# EAGLE board ElectronicLoad (EAGLE 9.5.1)
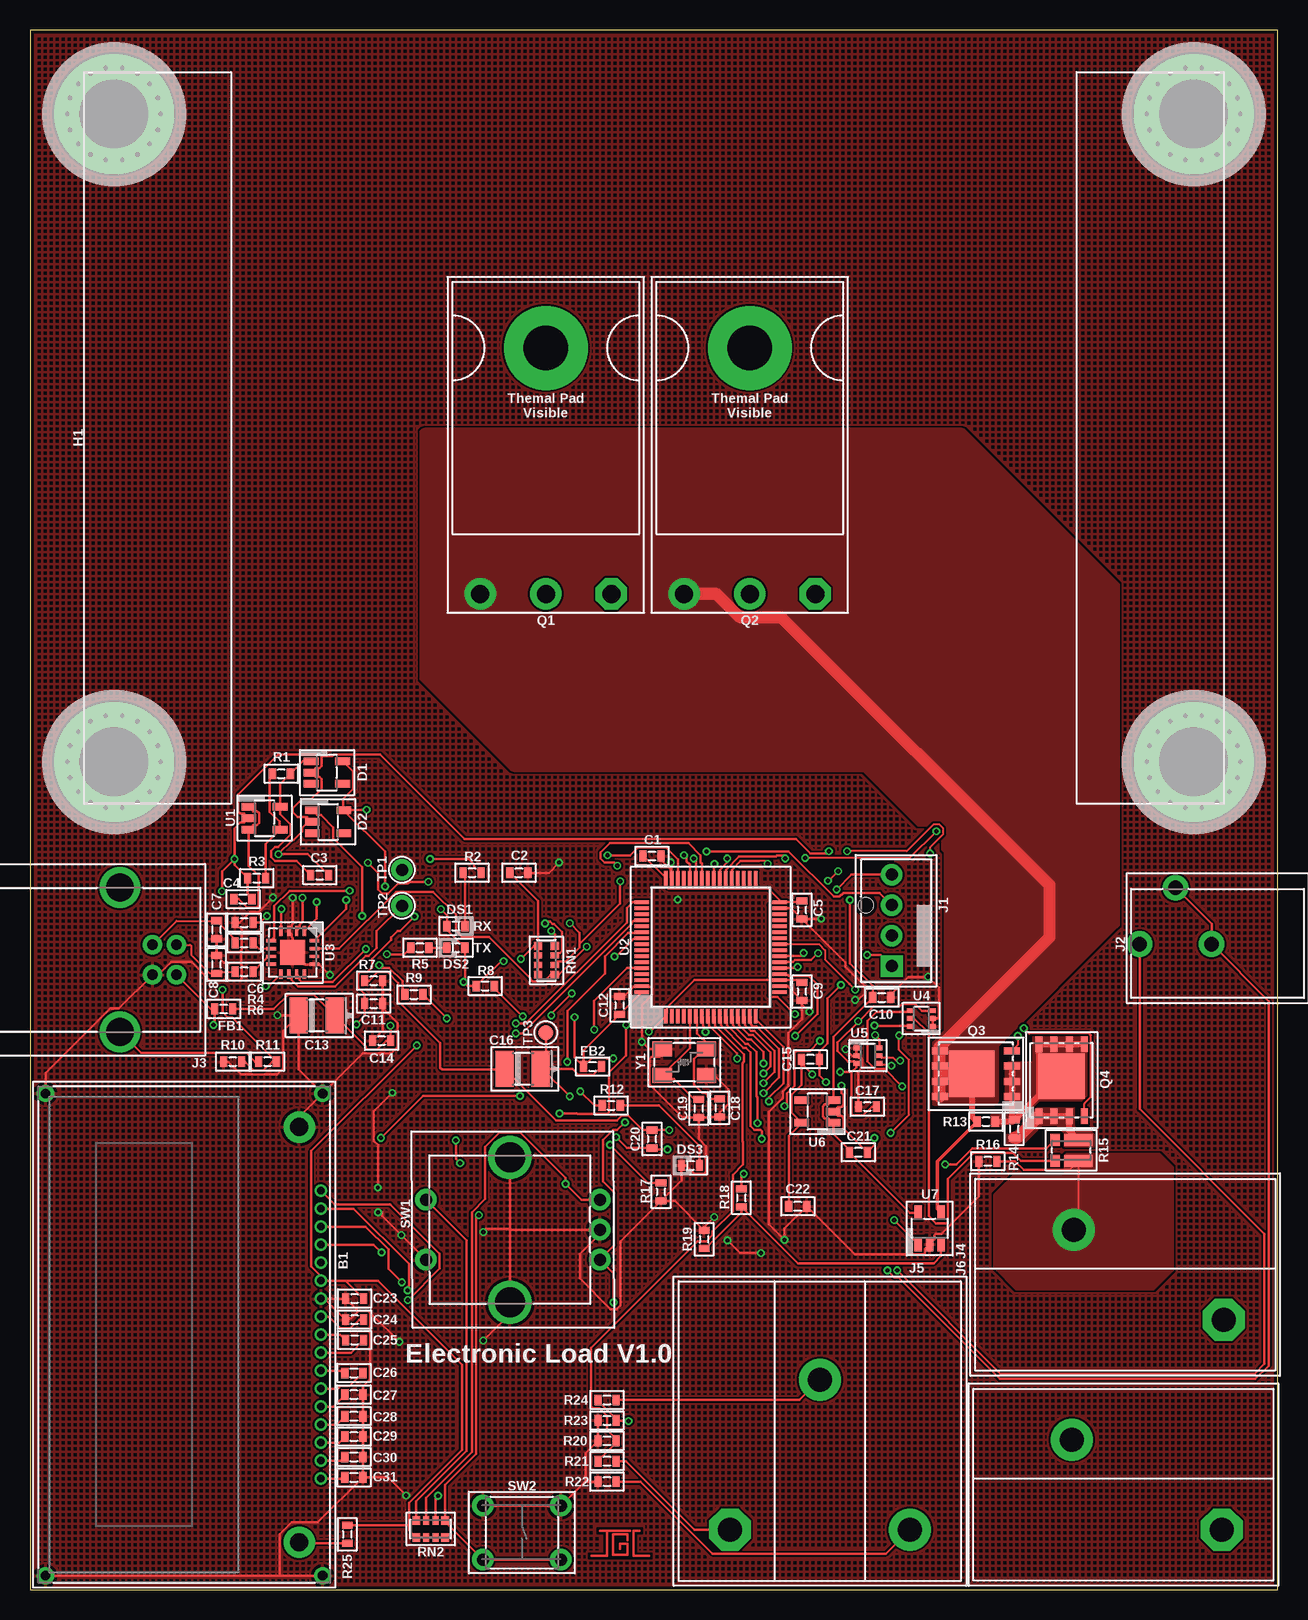
[diagram p5: board, top side]
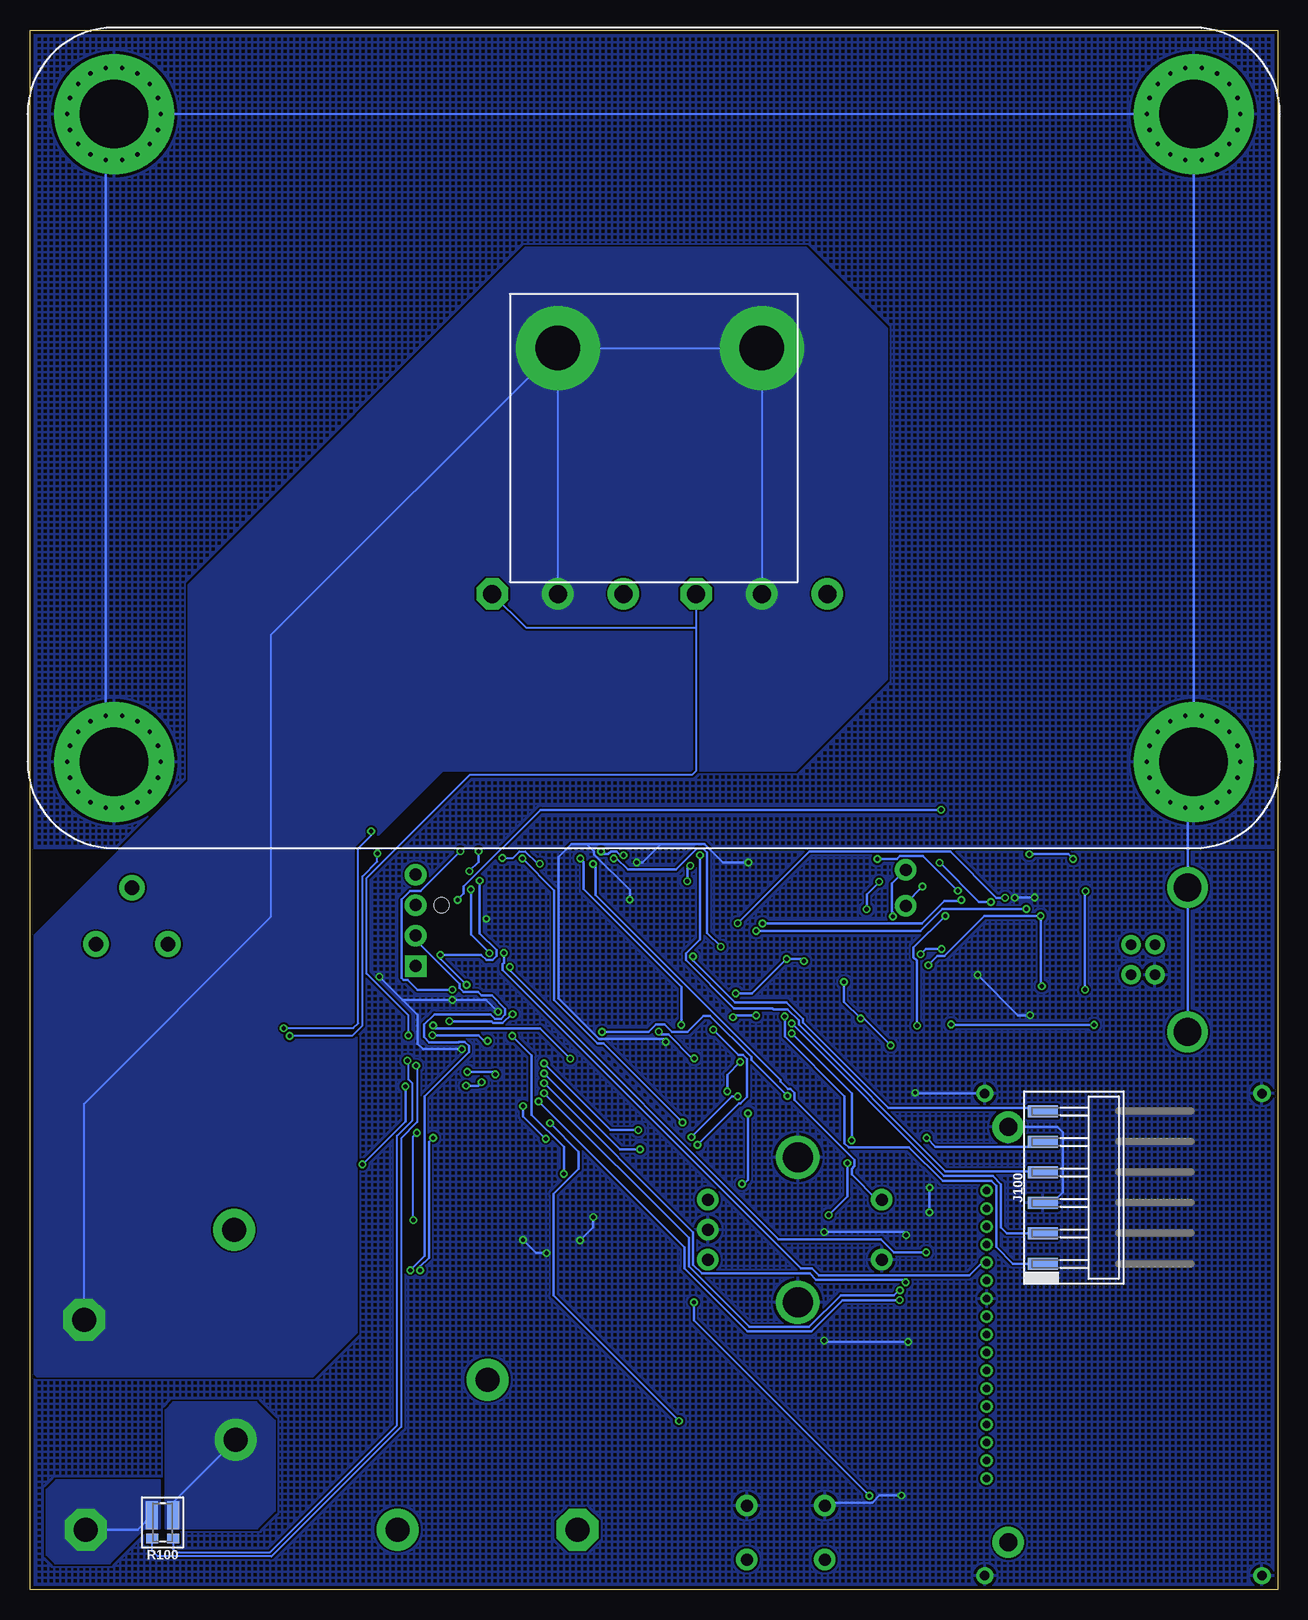
[diagram p6: board, bottom side, seen from below]

Size 104 x 130 mm. Coordinates in mm from the lower left corner, seen from the top.
Outline: 104,130 0,130 0,0 104,0 104,130
Copper layers (1*16): Top 0.035mm / dielectric 1.6mm / Bottom 0.035mm
Design rules "CougsInSpace": minimum track width 0.16mm, minimum drill 0.3mm, track to track 0.16mm, track to pad 0.16mm, pad to pad 0.16mm, via to via 0.16mm, smd to smd 0mil, copper to edge 0.3mm, drill to drill 0.3mm, minimum pad ring 0.15mm, minimum via ring 0.15mm, stop-mask expansion 0mil, vias tented up to drill 1mm, thermal gap 0.25mm

## Footprints (pad centres in the part's own frame; a part is rotated, then mirrored left to right if it is on the bottom)
NHD-C12832A1Z = drill 0.6 pad 1: 1 -12,0; 2 -10.5,0; 3 -9,0; 4 -7.5,0; 5 -6,0; 6 -4.5,0; 7 -3,0; 8 -1.5,0; 9 0,0; 10 1.5,0; 11 3,0; 12 4.5,0; 13 6,0; 14 7.5,0; 15 9,0; 16 10.5,0; 17 12,0 | drill 1.5 pad 2: A -17.3,1.8; K 17.3,1.8 | drill 0.8 pad 1.4: CHASSIS@1 -20.1,-0.15; CHASSIS@2 20.1,-0.15; CHASSIS@3 -20.1,22.95; CHASSIS@4 20.1,22.95
1608 = smd 0.6 x 0.9: 1 -0.75,0; 2 0.75,0
4028-POL = smd 1.5 x 3: A 1.5,0; C -1.5,0
SOT23-5 = smd 1.22 x 0.62: 1 -1.31,0.95; 2 -1.31,0; 3 -1.31,-0.95; 4 1.31,-0.95; 5 1.31,0.95
1608-POL = smd 0.6 x 0.9: A 0.75,0; C -0.75,0
HEATSINK-AM4 = drill 5.7 pad 10: 1 -45,27; 2 -45,-27; 3 45,-27; 4 45,27 | drill 0.35 pad 1: V1 -41.1,27; V2 -41.335,28.334; V3 -42.012,29.507; V4 -43.05,30.378; V5 -44.323,30.841; V6 -45.677,30.841; V7 -46.95,30.378; V8 -47.988,29.507; V9 -48.665,28.334; V10 -48.9,27; V11 -48.665,25.666; V12 -47.988,24.493; V13 -46.95,23.622; V14 -45.677,23.159; V15 -44.323,23.159; V16 -43.05,23.622; V17 -42.012,24.493; V18 -41.335,25.666; V19 -41.1,-27; V20 -41.335,-25.666; V21 -42.012,-24.493; V22 -43.05,-23.622; V23 -44.323,-23.159; V24 -45.677,-23.159; V25 -46.95,-23.622; V26 -47.988,-24.493; V27 -48.665,-25.666; V28 -48.9,-27; V29 -48.665,-28.334; V30 -47.988,-29.507; V31 -46.95,-30.378; V32 -45.677,-30.841; V33 -44.323,-30.841; V34 -43.05,-30.378; V35 -42.012,-29.507; V36 -41.335,-28.334; V37 48.9,-27; V38 48.665,-25.666; V39 47.988,-24.493; V40 46.95,-23.622; V41 45.677,-23.159; V42 44.323,-23.159; V43 43.05,-23.622; V44 42.012,-24.493; V45 41.335,-25.666; V46 41.1,-27; V47 41.335,-28.334; V48 42.012,-29.507; V49 43.05,-30.378; V50 44.323,-30.841; V51 45.677,-30.841; V52 46.95,-30.378; V53 47.988,-29.507; V54 48.665,-28.334; V55 48.9,27; V56 48.665,28.334; V57 47.988,29.507; V58 46.95,30.378; V59 45.677,30.841; V60 44.323,30.841; V61 43.05,30.378; V62 42.012,29.507; V63 41.335,28.334; V64 41.1,27; V65 41.335,25.666; V66 42.012,24.493; V67 43.05,23.622; V68 44.323,23.159; V69 45.677,23.159; V70 46.95,23.622; V71 47.988,24.493; V72 48.665,25.666
THT2.54-1X04-LOCK = drill 1 square: 1 5.08,0 | drill 1: 2 2.54,0; 3 0,0; 4 -2.54,0 | hole 1.25: 0,-2.16
BARREL-2.1X5.5-R = drill 1.2 pad 2: 1 0,-3; 2 0,3; 3 -4.7,0
USB-B-FEMALE = drill 0.9 pad 1.6: 1 1.25,4.71; 2 -1.25,4.71; 3 -1.25,2.71; 4 1.25,2.71 | drill 2.3 pad 3.4: SHIELD@1 -6.02,0; SHIELD@2 6.02,0
TERMINAL_SPRING-02 = drill 2 pad 3.5 octagon: 1 0,0 | drill 2 pad 3.5: 2 7.5,12.5
TERMINAL_SPRING-03 = drill 2 pad 3.5 octagon: 1 0,0 | drill 2 pad 3.5: 2 7.5,12.5; 3 15,0
SMD2.54-1X06-R = smd 1 x 2.5: 1 6.35,-5; 2 3.81,-5; 3 1.27,-5; 4 -1.27,-5; 5 -3.81,-5; 6 -6.35,-5
TO-247-3-DOWN = drill 1.5 pad 2.5 octagon: 1 -5.46,0 | drill 1.5 pad 2.5: 2 0,0; 3 5.46,0 | drill 3.7 pad 7: PAD 0,-20.5
POWERPAK-SO-8 = smd 1.3 x 0.6: 1 -3,1.905; 2 -3,0.635; 3 -3,-0.635; 4 -3,-1.905; 5 3,-1.905; 6 3,-0.635; 7 3,0.635; 8 3,1.905 | smd 3.8 x 3.9: PAD 0.35,0
1632-KELVIN = smd 1 x 2.32: 1 -0.875,-0.59; 2 0.9,-0.59 | smd 1 x 0.8: 1-KELVIN -0.875,1.35; 2-KELVIN 0.875,1.35
1632 = smd 0.64 x 0.7: 1 -1.2,-0.7; 4 1.2,-0.7; 5 1.2,0.7; 8 -1.2,0.7 | smd 0.5 x 0.7: 2 -0.4,-0.7; 3 0.4,-0.7; 6 0.4,0.7; 7 -0.4,0.7
PEC12R-4-S = drill 1 pad 1.6: 1 -2.5,7; 2 2.5,7; A -2.5,-7.5; B 2.5,-7.5; C 0,-7.5 | drill 2.5 pad 3.6: SHIELD@1 -6.05,0; SHIELD@2 6.02,0
THT-6060 = drill 1 pad 1.6: 1 3.25,-2.25; 2 -3.25,-2.25; 3 3.25,2.25; 4 -3.25,2.25
THT-1.0 = drill 1 pad 1.8: 1 0,0
SMD-C-1.25 = smd 1.25 x 1.25: 1 0,0
QFP-64-1010 = smd 1.2 x 0.3: 1 -5.75,3.75; 2 -5.75,3.25; 3 -5.75,2.75; 4 -5.75,2.25; 5 -5.75,1.75; 6 -5.75,1.25; 7 -5.75,0.75; 8 -5.75,0.25; 9 -5.75,-0.25; 10 -5.75,-0.75; 11 -5.75,-1.25; 12 -5.75,-1.75; 13 -5.75,-2.25; 14 -5.75,-2.75; 15 -5.75,-3.25; 16 -5.75,-3.75; 33 5.75,-3.75; 34 5.75,-3.25; 35 5.75,-2.75; 36 5.75,-2.25; 37 5.75,-1.75; 38 5.75,-1.25; 39 5.75,-0.75; 40 5.75,-0.25; 41 5.75,0.25; 42 5.75,0.75; 43 5.75,1.25; 44 5.75,1.75; 45 5.75,2.25; 46 5.75,2.75; 47 5.75,3.25; 48 5.75,3.75 | smd 0.3 x 1.2: 17 -3.75,-5.75; 18 -3.25,-5.75; 19 -2.75,-5.75; 20 -2.25,-5.75; 21 -1.75,-5.75; 22 -1.25,-5.75; 23 -0.75,-5.75; 24 -0.25,-5.75; 25 0.25,-5.75; 26 0.75,-5.75; 27 1.25,-5.75; 28 1.75,-5.75; 29 2.25,-5.75; 30 2.75,-5.75; 31 3.25,-5.75; 32 3.75,-5.75; 49 3.75,5.75; 50 3.25,5.75; 51 2.75,5.75; 52 2.25,5.75; 53 1.75,5.75; 54 1.25,5.75; 55 0.75,5.75; 56 0.25,5.75; 57 -0.25,5.75; 58 -0.75,5.75; 59 -1.25,5.75; 60 -1.75,5.75; 61 -2.25,5.75; 62 -2.75,5.75; 63 -3.25,5.75; 64 -3.75,5.75
QFN-16-4040 = smd 0.8 x 0.28: 1 -1.8,0.975; 2 -1.8,0.325; 3 -1.8,-0.325; 4 -1.8,-0.975; 9 1.8,-0.975; 10 1.8,-0.325; 11 1.8,0.325; 12 1.8,0.975 | smd 0.28 x 0.8: 5 -0.975,-1.8; 6 -0.325,-1.8; 7 0.325,-1.8; 8 0.975,-1.8; 13 0.975,1.8; 14 0.325,1.8; 15 -0.325,1.8; 16 -0.975,1.8 | smd 2.1 x 2.1: PAD 0,0
SOT363 = smd 0.5 x 0.4: 1 -0.95,0.65; 2 -0.95,0; 3 -0.95,-0.65; 4 0.95,-0.65; 5 0.95,0; 6 0.95,0.65
SMD-5032 = smd 1.6 x 1.25: 1 -1.85,-1.1; 2 1.85,-1.1; 3 1.85,1.1; 4 -1.85,1.1

## Placement (x,y rotation side)
B1  128x32p White on Blue  [NHD-C12832A1Z]  24.25,21.25 90 top
C1  100nF 10%  [1608]  51.85,61.15 0 top
C2  100nF 10%  [1608]  40.75,59.75 0 top
C3  1µF 10%  [1608]  24.15,59.55 0 top
C4  1µF 10%  [1608]  17.75,57.55 0 top
C5  100nF 10%  [1608]  64.35,56.65 270 top
C6  100nF 10%  [1608]  17.85,55.6 180 top
C7  47pF 5%  [1608]  15.55,55 270 top
C8  47pF 5%  [1608]  15.55,52.1 90 top
C9  100nF 10%  [1608]  64.35,49.85 270 top
C10  100nF 10%  [1608]  71,49.35 0 top
C11  10nF 10%  [1608]  28.65,48.85 0 top
C12  100nF 10%  [1608]  49.15,48.7 90 top
C13  4.7µF 10%  [4028-POL]  23.9,47.85 0 top
C14  100nF 10%  [1608]  29.3,45.75 180 top
C15  1µF 10%  [1608]  65.05,44.2 0 top
C16  4.7µF 10%  [4028-POL]  41.05,43.4 0 top
C17  100nF 10%  [1608]  69.8,40.25 180 top
C18  10pF 5%  [1608]  57.5,40.15 270 top
C19  10pF 5%  [1608]  55.75,40.1 270 top
C20  100nF 10%  [1608]  51.85,37.55 90 top
C21  1µF 10%  [1608]  69.05,36.45 0 top
C22  100nF 10%  [1608]  64,31.95 0 top
C23  100nF 10%  [1608]  27.05,24.25 180 top
C24  1µF 10%  [1608]  27.05,22.5 0 top
C25  1nF 1%  [1608]  27.05,20.8 180 top
C26  1nF 1%  [1608]  27,18.05 0 top
C27  1µF 10%  [1608]  27,16.25 0 top
C28  1µF 10%  [1608]  27,14.45 0 top
C29  1µF 10%  [1608]  27,12.75 0 top
C30  1µF 10%  [1608]  27,11.05 0 top
C31  1µF 10%  [1608]  27,9.35 0 top
D1  LTC4411  [SOT23-5]  24.75,68.1 0 top
D2  LTC4411  [SOT23-5]  24.85,64 0 top
DS1  Red  [1608-POL]  35.5,55.3 180 top
DS2  Green  [1608-POL]  35.5,53.5 0 top
DS3  Green  [1608-POL]  55.05,35.35 0 top
FB1  1.5kΩ @ 100MHz  [1608]  16.15,48.4 0 top
FB2  1.5kΩ @ 100MHz  [1608]  46.9,43.6 0 top
H1  AM4 Heatsink  [HEATSINK-AM4]  52,96 0 top
J1  FAN  [THT2.54-1X04-LOCK]  71.85,57.05 270 top
J2  12 V Input  [BARREL-2.1X5.5-R]  95.5,53.8 270 top
J3  USB  [USB-B-FEMALE]  7.5,52.5 270 top
J4  Load Input  [TERMINAL_SPRING-02]  99.5,22.5 90 top
J5  Voltage Input  [TERMINAL_SPRING-03]  58.35,5 0 top
J6  Auxiliary Current Input  [TERMINAL_SPRING-02]  99.35,5 90 top
J100  SWD  [SMD2.54-1X06-R]  14.55,33.5 270 bottom
LOGO1  SIGNATUREJAYSON  [SIGN-JAYSON]  49.2,3.8 0 top
Q1  IRFP4368PBF  [TO-247-3-DOWN]  43,83 180 top
Q2  IRFP4368PBF  [TO-247-3-DOWN]  60,83 180 top
Q3  SiRA20DP  [POWERPAK-SO-8]  78.85,43 180 top
Q4  SiRA20DP  [POWERPAK-SO-8]  86,42.45 90 top
R1  10kΩ 0.1%  [1608]  20.95,68 0 top
R2  1kΩ 0.1%  [1608]  36.85,59.75 180 top
R3  30kΩ 1%  [1608]  18.9,59.3 0 top
R4  27Ω 1%  [1608]  17.85,53.9 0 top
R5  1kΩ 0.1%  [1608]  32.5,53.5 0 top
R6  27Ω 1%  [1608]  17.85,51.5 0 top
R7  0Ω <20mΩ  [1608]  28.65,50.75 0 top
R8  1kΩ 0.1%  [1608]  37.95,50.3 180 top
R9  10kΩ 0.1%  [1608]  32,49.6 180 top
R10  0Ω <20mΩ  [1608]  16.9,44 180 top
R11  0Ω <20mΩ  [1608]  19.8,44 180 top
R12  1kΩ 0.1%  [1608]  48.45,40.35 180 top
R13  510mΩ 1%  [1608]  79.7,39 180 top
R14  50mΩ 1%  [1608]  82.05,38.4 90 top
R15  5mΩ 1%  [1632-KELVIN]  86.8,36.6 90 top
R16  1kΩ 0.1%  [1608]  79.85,35.7 0 top
R17  0Ω <20mΩ  [1608]  52.6,33.15 90 top
R18  47kΩ 0.1%  [1608]  59.3,32.65 90 top
R19  1kΩ 0.1%  [1608]  56.2,29.2 270 top
R20  10kΩ 0.1%  [1608]  48.1,12.4 0 top
R21  30kΩ 1%  [1608]  48.1,10.7 0 top
R22  1kΩ 0.1%  [1608]  48.1,9 0 top
R23  10kΩ 0.1%  [1608]  48.1,14.1 0 top
R24  30kΩ 1%  [1608]  48.1,15.8 0 top
R25  0Ω <20mΩ  [1608]  26.45,4.6 270 top
R100  5mΩ 1%  [1632-KELVIN]  92.95,5.6 180 bottom
RN1  10kΩ 1%  [1632]  43.05,52.45 90 top
RN2  10kΩ 1%  [1632]  33.4,5.05 180 top
SW1  Control Knob  [PEC12R-4-S]  40,30 90 top
SW2  Nice Button  [THT-6060]  41,4.75 0 top
TP1  TEST_POINT-THT-1.0  [THT-1.0]  31,60 0 top
TP2  TEST_POINT-THT-1.0  [THT-1.0]  31,57 0 top
TP3  TEST_POINT-SMD-C-1.25  [SMD-C-1.25]  43,46.4 0 top
U1  TPS73250  [SOT23-5]  19.55,64.3 0 top
U2  STM32L476RGT  [QFP-64-1010]  56.75,53.55 90 top
U3  FT230XQ  [QFN-16-4040]  21.9,53.1 270 top
U4  INA199C1  [SOT363]  74.3,47.6 180 top
U5  INA199C1  [SOT363]  69.85,44.5 0 top
U6  LP5907MFX-3.1  [SOT23-5]  65.65,39.85 180 top
U7  AD8515  [SOT23-5]  75,30.1 90 top
Y1  8MHz ±10ppm  [SMD-5032]  54.55,43.95 180 top

## Tracks (layer width: path | path; a pad name or v marks a point on that pad's centre or on a via)
3.1V  (via drill 0.35)
  Top 0.2: RN2.8 RN2.7 RN2.6 RN2.5 31.6,4.95 31.6,5.35 | 31.6,5.35 R25.1 | B1.12 29,25.75 36,18.75 36,11.65 31.6,7.25 31.6,5.35 | C1.1 | C2.1 42.35,57.4 RN1.5 | R9.1 v34.75,47.6 | B1.12 24.25,26.12 23.45,26.92 23.45,36.55 v32.25,45.35 | B1.12 26.3,25.75 C23.1 | U2.19 62.55,50.8 | 62.55,50.8 64.15,50.8 C9.1 | 62.65,57.3 U2.32 62.41,57.21 61.79,57.21 61.64,57.06 61.64,51.04 61.83,50.85 62.5,50.85 62.55,50.8 | 62.65,57.3 64.25,57.3 C5.1 | U2.64 C12.1 46.15,44.95 FB2.1 | C1.1 51.15,61.15 U2.48 53.05,59.25 53.05,58.63 53.24,58.44 61.51,58.44 62.65,57.3 | C22.1 63.25,37.81 U6.5 63.47,39.77 63.47,41.22 64.3,42.05 C15.1 64.3,43.86 v65.22,42.95 | 68.49,43.13 68.9,43.54 U5.3 68.71,44.04 68.18,44.04 67.32,44.9 67.32,45.6 69.09,47.36 | 68.49,43.13 68.49,39.69 68.64,39.54 69.46,39.54 70.17,40.25 C17.1 | U4.3 74.37,48.25 73.82,48.8 72.7,48.8 72.49,48.59 70.31,48.59 69.09,47.36 | U3.1 23.9,55.92 v23.9,57.32 | v33.2,59 31.64,59 31.48,58.84 30.67,58.84 29.84,58.02 29.36,58.02 29.02,58.36 29.02,59.73 v28.16,60.59 | v34.25,56.7 34.75,56.2 DS1.A 34.75,55 DS2.A 36.25,50.75 v36.14,50.64 36.48,50.3 R8.2 39.27,52.37 v39.47,52.37 | 68.49,43.13 68.47,43.15 v67.55,43.15 | RN1.8 RN1.7 | FB2.1 45.38,44.36 v45.38,47.7 | v43.45,47.85 43.45,47.98 v45.16,49.69 | v40.92,52.57 42,53.65 RN1.5 | U2.19 55.38,50.8 53.09,48.51 53.09,48.05 53,47.96 U2.1 51.7,46.5 v51.59,46.5 | v48.62,44.28 48.09,44.28 48.06,44.31 46.86,44.31 FB2.1 | RN1.7 RN1.5 | RN1.6 RN1.7 | U2.19 62.41,50.71 61.79,50.71 61.64,50.56 61.64,49.54 61.79,49.39 62.33,49.39 v63.77,47.95 | v69.04,47.37 69.08,47.37 69.09,47.36
  Bottom 0.2: v32.25,45.35 34.5,47.6 v34.75,47.6 36.14,48.99 v36.14,50.64 | v23.9,57.32 24.89,57.32 v28.16,60.59 | v33.2,59 34.25,57.95 v34.25,56.7 | v67.55,43.15 65.41,43.15 v65.22,42.95 | v45.38,47.7 45.23,47.85 v43.45,47.85 | v45.16,49.69 43.81,49.69 v40.92,52.57 39.67,52.57 v39.47,52.37 | v51.59,46.5 51.34,46.26 50.78,46.26 48.8,44.28 v48.62,44.28 | v63.77,47.95 63.86,47.95 64.59,47.22 65.38,47.22 65.53,47.37 v69.04,47.37
5.0V  (via drill 0.35)
  Top 0.2: TP2.1 28.9,54.9 28.9,53.47 28.24,52.81 27.96,52.81 25.43,50.28 22.34,50.28 21.82,50.79 21.82,51.05 U3.10 | U7.5 73.34,31.41 C21.1 68.4,36.55 66.96,37.99 U6.1 66.58,39.28 66.24,39.28 66.09,39.43 66.09,40.27 66.24,40.42 66.58,40.42 U6.3 66.96,46.06 C10.1 70.25,50.3 68.35,52.2 v68.35,57.49 | D1.5 26.93,68.18 26.93,66.73 26.1,65.9 26.1,64.95 D2.5 26.2,64.91 | 26.2,64.91 29.6,61.51 v29.6,58.6 | v28.05,65 26.3,65 26.2,64.91
  Bottom 0.2: v29.6,58.6 31,57.2 TP2.1 | v68.35,57.49 67.84,58.01 67.84,58.59 61.43,65 v28.05,65
12.0V  (via drill 0.35)
  Top 0.2: J2.1 92.5,40.05 102.9,29.65 102.9,18.8 102.1,18 80.91,18 v72.3,26.62
  Bottom 0.2: v72.3,26.62 71.1,27.81 71.1,41.12 67.41,44.81 67.41,45.29 67.76,45.64 68.24,45.64 68.26,45.62 70.72,45.62 71.15,46.05 71.15,47.09 70.28,47.96 65.61,47.96 65.23,47.58 64.74,47.58 64.4,47.92 64.4,48.41 65.5,49.5 66.35,49.5 66.66,49.81 67.84,49.81 68.18,50.15 68.18,50.47 71.85,54.14 J1.2
!CTS  (via drill 0.35)
  Top 0.2: RN1.4 43.75,54.6 v43.45,54.9 | v20.95,56.73 20.95,54.92 U3.4
  Bottom 0.2: v43.45,54.9 29.77,54.9 27.93,56.74 27.44,56.74 27.44,56.73 v20.95,56.73
!LCD_CS  (via drill 0.35)
  Top 0.2: U2.16 60.5,47.51 62.8,45.21 62.8,42.21 61.6,41 v61.6,40.69 | B1.17 25.39,32.11 30.03,32.11 34.16,27.98 34.16,26.78 v31.5,24.12
  Bottom 0.2: v61.6,40.69 49.44,28.53 49.44,26.78 44.19,21.53 38.84,21.53 36.25,24.12 v31.5,24.12
!LCD_RST  (via drill 0.35)
  Top 0.2: U2.15 60.09,47.71 60.09,47.09 60.24,46.94 60.56,46.94 62.44,45.06 62.44,42.67 v61.13,41.37 | v31.47,24.93 31.47,25.25 31.59,25.36 31.59,27.15 26.99,31.75 B1.16
  Bottom 0.2: v61.13,41.37 49.08,29.31 49.08,26.93 44.04,21.89 39.05,21.89 36.41,24.53 31.97,24.53 31.57,24.93 v31.47,24.93
!RTS  (via drill 0.35)
  Top 0.2: RN1.3 43.97,53.07 44.21,53.07 44.36,53.22 44.36,54.82 43.69,55.48 43.56,55.48 43.35,55.7 43.1,55.7 v42.94,55.53 | v26.35,57.47 26.35,56.73 U3.16
  Bottom 0.2: v42.94,55.53 29.64,55.53 27.78,57.4 26.42,57.4 v26.35,57.47
AGND  (via drill 0.35)
  Top 0.2: U2.12 58.59,47.71 58.59,47.06 59.8,45.86 60.09,45.86 61.13,44.81 v61.13,43.85 | v53.3,38.3 C20.2 51.08,38.3 49.84,39.53 49.36,39.53 48.92,39.1 43.85,39.1 C16.C 39.49,43.34 34.34,43.34 34.19,43.49 34.19,45.54 30.69,49.04 30.69,50.58 29.81,51.46 28.99,51.46 28.28,50.75 R7.1
  Bottom 0.2: v61.13,43.85 55.59,38.3 v53.3,38.3
AVDD  (via drill 0.35)
  Top 0.2: U2.13 59.09,47.71 59.09,47.07 59.94,46.22 60.26,46.22 61.72,44.76 61.72,43.61 v61.13,43.02 | v53.15,36.7 51.95,36.7 C20.1 49.77,36.8 v48.85,37.72 | 43,43.4 45.23,43.4 45.74,42.89 46.94,42.89 FB2.2 | 43,43.4 42.7,43.4 | 42.7,43.4 C16.A | v45,41.1 42.7,43.4 | TP3.1 43,43.4
  Bottom 0.2: v61.13,43.02 54.81,36.7 v53.15,36.7 | v48.85,37.72 45.47,41.1 v45,41.1
BOOT0  (via drill 0.35)
  Top 0.2: U2.60 49.75,51.8 47.03,49.08 47.03,47 47.04,46.98 v47.04,46.67 | v48.35,37.07 51.52,33.9 R17.2
  Bottom 0.2: v47.04,46.67 44.94,44.57 44.56,44.57 44.22,44.23 44.22,41.06 44.76,40.52 44.9,40.52 v48.35,37.07
C1+
  Top 0.2: B1.8 26.75,19.75 C25.1
C1-
  Top 0.2: B1.9 25.85,21.25 C25.2
C2+
  Top 0.2: B1.7 26.05,18.25 C26.1
C2-
  Top 0.2: C26.2 26.66,16.96 25.84,16.96 25.63,16.75 B1.6
CBUS1  (via drill 0.35)
  Top 0.2: U3.11 22.48,51.05 22.48,50.79 22.63,50.64 25.24,50.64 v28,53.4 | v29.75,52.95 31.2,52.95 R5.1
  Bottom 0.2: v28,53.4 29.3,53.4 v29.75,52.95
CBUS2  (via drill 0.35)
  Top 0.2: U3.5 20.36,54.34 20.36,56.98 21.64,58.25 v26.65,58.25 | R2.1 37.02,60.33 37.02,60.46 36.58,60.9 v33.35,60.9
  Bottom 0.2: v33.35,60.9 31.74,60.9 31.48,61.16 29.56,61.16 v26.65,58.25
CHASSIS
  Top 0.2: R11.2 18.77,44 18.06,44.71 9.27,44.71 J3.SHIELD@2
  Bottom 0.18: H1.V15 8.14,119.62 H1.V16 9.82,120.49 H1.V17 | H1.V1 93.05,123 93.1,122.95 | H1.V64 96.94,126.84 H1.V59
  Bottom 0.2: J3.SHIELD@2 J3.SHIELD@1 7.5,64.98 H1.V33 | H1.V33 8.14,65.62 H1.V34 10.66,67.34 H1.V36 10.9,67.9 H1.V19 10.9,70.1 H1.V20 9.99,71.01 H1.V21 9.12,72.38 H1.V22 8.14,72.38 H1.V23 H1.V24 | H1.2 5.05,70.95 H1.V25 | H1.2 4.49,71.51 H1.V26 | H1.2 7,65.84 H1.V33 | 4.67,69 H1.V27 | H1.2 H1.V28 | H1.2 4.67,69 | 4.67,69 H1.V29 | H1.2 6.52,69 H1.V30 | H1.2 5.05,67.05 H1.V31 5.86,65.62 H1.V32 | H1.2 7.48,69 H1.V35 | H1.2 7,118.48 H1.V15 | H1.1 7,119.84 H1.V14 | H1.1 7,121.57 H1.V13 | H1.1 4.49,120.49 H1.V12 3.34,121.17 H1.V11 3.1,121.9 H1.V10 3.1,124.1 H1.V9 3.34,124.83 H1.V8 4.88,126.38 H1.V7 5.51,126.84 H1.V6 H1.V5 | H1.1 8.95,124.95 H1.V4 | H1.1 9.51,125.51 H1.V3 | H1.1 8.33,124.33 H1.V2 | H1.1 H1.V1 | H1.1 9.33,123 H1.V18 | H1.1 7.48,123 H1.V17 | H1.1 8.95,121.05 H1.V16 | H1.4 98.95,124.95 98.95,126.25 | 98.95,126.25 H1.V58 96.79,126.38 H1.V60 95.51,126.84 H1.V61 94.88,126.38 H1.V62 93.34,124.83 H1.V63 93.1,124.1 H1.V64 93.1,122.95 93.1,121.9 H1.V65 93.34,121.17 H1.V66 94.88,119.62 H1.V67 95.51,119.16 H1.V68 H1.V69 | H1.V69 97.75,119.16 | 97.75,119.16 98.49,119.16 H1.V70 99.82,120.49 H1.V71 | 99.33,123 H1.V72 | H1.4 H1.V55 | H1.4 99.33,123 | 99.33,123 H1.V56 99.99,125.01 H1.V57 99.24,126.25 98.95,126.25 | H1.4 97.75,122.25 97.75,119.16 | H1.V69 H1.V41 | H1.V41 H1.V42 95.86,72.38 H1.V43 94.18,71.51 H1.V44 94.01,71.01 H1.V45 93.34,69.23 H1.V46 93.34,68.77 H1.V47 94.01,66.99 H1.V48 94.88,65.62 H1.V49 95.51,65.16 H1.V50 H1.V51 | H1.V51 98.49,65.16 H1.V52 99.82,66.49 H1.V53 | 99.33,69 H1.V54 | H1.3 H1.V37 | H1.3 99.33,69 | 99.33,69 H1.V38 99.99,71.01 H1.V39 99.12,72.38 H1.V40 98.49,72.84 H1.V41 | H1.V41 97,72.16 H1.3
  Bottom 0.2: H1.3 97,65.84 H1.V51
  pour Bottom (rank 2, hatched): 0,130 0,61.8 104,61.8 104,130
DGND  (via drill 0.3, 0.35)
  Top 0.2: C31.2 C30.2 C29.2 C28.2 C27.2 27.75,16.93 28.36,17.54 28.36,23 | B1.CHASSIS@3 20.81,1.15 | 20.81,1.15 20.81,4.6 21.8,5.59 23.99,5.59 C31.2 | SW2.4 SW2.3 46.25,9 46.3,9 | C24.1 26.2,22.6 | 26.2,22.6 24.55,24.25 B1.11 C23.2 27.34,23.21 27.39,23.21 | C19.2 56.45,39.35 56.5,39.4 C18.2 57.5,39.78 58.21,40.49 58.21,41.69 57.05,42.85 Y1.4 | R17.1 53.75,32.4 R19.1 56.2,30.2 v57.05,31.05 | R17.1 54.3,34.1 DS3.C 54.68,35.35 55.39,34.64 56.21,34.64 56.36,34.79 56.36,36.95 55.75,37.56 C19.2 | R10.2 16.53,44 17.6,42.93 20.6,42.93 21.11,43.44 21.11,46.56 22.38,47.83 | 22.38,47.83 C13.C 20.65,47.85 v20.63,47.87 | B1.CHASSIS@2 22.38,43.38 22.38,47.83 | B1.K 22.45,39.4 B1.CHASSIS@2 | C7.2 C8.2 16.19,52.21 17.51,52.21 17.58,52.13 | B1.CHASSIS@4 1.3,43.05 6.69,48.44 7.4,48.44 J3.4 10.7,51.25 11.77,52.32 13.46,52.32 14.99,50.79 17.51,50.79 17.66,50.94 17.66,52.06 17.58,52.13 | R7.2 C11.2 | C11.2 29.4,46.6 C14.2 | 40,30 SW1.SHIELD@1 40,22.97 v37.78,20.75 | 40,30 40,30.05 | 40,30.05 SW1.SHIELD@2 | C31.2 29.85,9.35 v31.36,7.84 | 17.58,52.13 17.58,53.27 17.66,53.34 17.66,55.04 C6.2 17.48,55.6 18.36,56.48 19.06,56.48 19.42,56.84 19.42,56.86 v20.25,57.7 | 27.39,23.21 28.21,23.21 28.36,23.06 28.36,23 | 26.2,22.6 26.78,22.6 27.39,23.21 | C19.2 54.41,39.35 51.64,42.12 51.64,44.23 51.79,44.39 52.49,44.39 52.7,44.59 Y1.2 51.6,45.05 v51,45.65 51,48.68 51.86,49.54 51.86,50.06 51.71,50.21 51.09,50.21 U2.63 50.91,50.21 50.29,50.21 49.53,49.45 C12.2 | v25,51.23 24.1,52.12 U3.13 22.88,52.12 U3.PAD 21.9,54.32 21.82,54.39 21.82,54.65 U3.3 21.82,55.15 21.82,55.41 21.9,55.48 v21.9,57.66 | B1.CHASSIS@2 27.73,44.68 30.1,44.68 30.64,45.22 30.64,47.24 29.4,48.48 C11.2
  Top 0.2: U4.1 U4.2 75.62,47.6 75.76,47.74 75.76,50.19 v74.87,51.08 73.23,51.08 71.75,49.6 C10.2 | U2.18 63.15,50.3 64.28,49.17 | 64.28,49.17 C9.2 64.35,47.53 63.22,46.39 63.22,41.98 62.75,41.52 62.75,40.98 61.59,39.81 61.59,30.44 v62.89,29.14 62.89,30.09 C22.2 68.78,27.92 74.47,27.92 74.62,28.07 74.62,28.41 U7.2 75.38,29.17 75.38,29.51 75.53,29.66 76,29.66 79.1,32.76 R16.1 | U2.31 63.45,56.8 C5.2 | 53.42,59.38 53.41,59.39 53.41,60.01 52.6,60.82 C1.2 | C2.2 43.25,59.75 v44.1,60.6 | C17.2 69.05,43.18 69.41,43.54 69.41,44.16 69.26,44.31 69.09,44.31 U5.2 | U5.2 U5.1 | v60.95,28.05 59.2,28.05 v58.15,29.1 | v68,45.05 68.55,44.5 U5.2 | v64.99,48.16 64.28,48.88 64.28,49.17 | SW1.1 v30.95,29.55 29.35,31.15 29.35,31.45 v29.02,31.45 | v30.8,20.65 28.45,23 28.36,23 | R17.1 49.23,29.03 49.23,23.71 48.89,23.37 48.41,23.37 45.84,25.93 45.84,27.98 47.5,29.64 SW1.C 40,30 | 40,30.05 38.03,30.05 v37.78,29.8 | C5.2 67.99,52.26 67.99,51.91 69.6,50.3 69.6,49.7 69.12,49.23 69.04,49.14 v68.8,49.14 | v53.42,60.6 53.42,59.38 | 53.42,59.38 U2.47 | C5.2 v65.97,55.9 | v29,33.5 29,37.07 28.66,37.41 28.66,39.86 v30.2,41.4 | 46.3,9 R22.1 | R23.1 R20.1 46.3,11.35 46.3,9 | B1.CHASSIS@1 20.81,1.15
  Bottom 0.2: v31.36,7.84 33.17,7.84 33.77,7.23 37.52,7.23 SW2.4 | v25,51.23 21.64,47.87 v20.63,47.87 | v44.1,60.6 46.21,60.6 47.76,62.15 51.4,62.15 | v51,45.65 51.25,45.9 56.55,45.9 59.94,49.28 59.94,61.06 58.85,62.15 57.6,62.15 | 57.6,62.15 51.4,62.15 | v62.89,29.14 61.8,28.05 v60.95,28.05 | v58.15,29.1 57.05,30.2 v57.05,31.05 | v68,45.05 71.24,45.05 71.67,45.48 71.67,47.88 v74.87,51.08 72.94,49.14 v68.8,49.14 65.96,49.14 v64.99,48.16 | v20.25,57.7 21.87,57.7 v21.9,57.66 | v37.78,20.75 37.69,20.65 v30.8,20.65 | v37.78,29.8 31.2,29.8 v30.95,29.55 | 51.4,62.15 52.95,60.6 v53.42,60.6 | B1.CHASSIS@2 30.15,41.35 v30.2,41.4 | 57.6,62.15 56.98,61.53 56.98,61.29 54,58.3 v54,57.5 | J100.3 18.77,32.23 17.9,33.1 17.9,38.1 18.35,38.55 B1.K | v29.02,31.45 29.02,33.48 v29,33.5
  pour Bottom (rank 3, hatched): 0,129.9 104,129.9 104,0 0,0
  pour Top (rank 3, hatched): 0,129.9 104,129.9 104,0 0,0
ENC_A  (via drill 0.35)
  Top 0.2: RN2.2 33.8,7.6 v34.02,7.82 | U2.38 58,59.99 59.1,61.09 62.19,61.09 62.27,61.17 62.73,61.17 v62.95,60.95 | v49.6,38.95 48.95,38.3 48.61,38.3 47.77,37.46 47.77,34.03 48.7,33.1 48.7,28.7 SW1.A 48.65,26.35 v48.65,23.95
  Bottom 0.2: v34.02,7.82 48.65,22.45 v48.65,23.95 | v62.95,60.95 60.3,58.29 60.3,49.13 56.7,45.54 56.19,45.54 v49.6,38.95
ENC_B  (via drill 0.35)
  Top 0.2: RN2.3 33,7.63 36.84,11.47 36.84,31.45 37.94,32.55 37.94,36.9 39.15,38.11 40.85,38.11 44.66,34.31 v44.66,33.81 45.96,32.5 SW1.B | U2.39 57.5,60 58.13,60.63 v58.13,60.95 | v44.15,39.7 45.57,39.7 45.63,39.64 48.11,39.64 48.26,39.79 48.26,43.09 49.7,44.53 v49.7,47.07
  Bottom 0.2: v58.13,60.95 57.85,60.66 57.85,58.38 49.7,50.23 v49.7,47.07 | v44.66,33.81 44.49,33.81 44.15,34.15 v44.15,39.7
ENC_SW  (via drill 0.35)
  Top 0.2: RN2.4 32.2,7.34 36.41,11.55 36.41,29.09 SW1.2 | U2.40 57,60.15 57.06,60.21 v57.06,60.49
  Bottom 0.2: v57.06,60.49 56.86,60.29 56.86,57.9 41.44,42.48 41.44,42.35 40.82,41.73 40.61,41.73 40.27,41.39 40.27,40.79 35.27,35.79 35.27,35.31 35.49,35.08 35.49,34.6 33.39,32.5 SW1.2
FAN_CONTROL  (via drill 0.35)
  Top 0.2: J1.4 68.49,59.59 v67.25,58.35 | U2.22 63.59,52.3 63.76,52.47 65.12,52.47 v65.7,53.05
  Bottom 0.2: v67.25,58.35 67.25,54.6 v65.7,53.05
FAN_SENSE  (via drill 0.35)
  Top 0.2: U2.44 55,60.45 54.74,60.7 54.74,60.98 v54.52,61.2 | v56.4,61.53 63.24,61.53 67.01,57.77 67.49,57.77 67.8,58.08 70.83,58.08 J1.3
  Bottom 0.2: v54.52,61.2 54.76,61.2 55.09,61.53 55.57,61.53 55.8,61.31 56.38,61.31 56.4,61.33 v56.4,61.53
FEEDBACK
  Top 0.2: Q3.6 75.85,43.9
  Top 0.3: U7.4 75.65,31.71 75.65,35.7 R13.2
  Top 0.5: 75.85,43.6 Q3.7 Q3.8 | 75.85,43.9 Q3.5 | Q3.PAD 78.5,39.45 R13.2
  Top 1: Q3.8 75.85,43.6 | 75.85,43.6 75.85,43.9 75.85,45.25 85,54.4 85,58.7 62.66,81.04 59.19,81.04 57.23,83 Q2.3 | Q3.PAD 76.45,43 75.85,43.6
  pour Top (no thermals): 32.92,96.35 32.92,76.08 40.35,68.65 69.65,68.65 76.65,61.65 76.65,46.4 75.5,45.25 75.5,40.8 80.3,40.8 80.3,45.5 90.4,55.6 90.4,83.6 77.65,96.35
FET_1  (via drill 0.35)
  Top 0.18: 68.3,50.5 66.28,52.52 66.28,53.29 65.76,53.8 U2.25 | v82.35,46.15 82.35,45.41 Q3.4 | v75.05,61.35 75.05,61.89 76.13,62.97 76.13,63.44 75.79,63.78 75.32,63.78 73.09,61.55 v68.12,61.55
  Top 0.2: 68.3,50.5 v68.8,50
  Bottom 0.18: v82.35,46.15 77.15,46.15 76.3,47 76.3,59.4 76.29,59.41 76.29,59.44 75.05,60.68 v75.05,61.35
  Bottom 0.2: v68.8,50 71.7,50 72.51,50.81 72.86,50.81 73.01,50.96 73.01,57.53 72.33,58.21 71.46,58.21 v68.12,61.55
FET_2  (via drill 0.35)
  Top 0.18: Q4.4 87.91,40.5 88.45,41.05 88.45,46.2 88.31,46.35 83.3,46.35 v82.85,46.8 | v75.55,63.2 73.33,60.98 v64.62,60.98 | v61.5,60.51 61.27,60.73 60.75,60.73
  Top 0.2: U2.37 58.5,59.98 59.25,60.73 60.75,60.73
  Bottom 0.18: v82.85,46.8 77.05,46.8 76.64,47.21 76.64,61.79 75.55,62.87 v75.55,63.2 | v64.62,60.98 63.74,60.98 63.19,61.52 62.71,61.52 61.7,60.51 v61.5,60.51
FET_GATE  (via drill 0.35)
  Top 0.18: v72.45,46.2 72.45,44.99 73.28,44.16 73.28,39.58 v71.76,38.06
  Top 0.2: v72.05,30.79 U7.1
  Bottom 0.16: Q1.1 48.46,80.2 | 48.46,80.2 48.46,68.24 48.8,67.9 67.35,67.9 74.28,60.98 | Q2.1 62.66,80.2 48.46,80.2
  Bottom 0.18: v72.05,30.79 72.05,37.76 v71.76,38.06 | v72.45,46.2 72.45,47.84 75.95,51.34 75.95,59.3 74.28,60.98
I_ADJ  (via drill 0.35)
  Top 0.2: v59.5,34.65 59.3,34.45 R18.2 | v63.8,46.15 65.65,48 65.65,50.42 64.91,51.16 63.26,51.16 63.21,51.21 62.59,51.21 U2.20
  Bottom 0.2: v59.5,34.65 59.5,36.9 62.18,39.58 62.18,44.53 v63.8,46.15
I_ALT  (via drill 0.35)
  Top 0.2: U2.10 57.59,47.71 57.59,47.05 59.5,45.14 59.7,45.14 60.06,44.78 60.06,38.64 60.41,38.29 60.89,38.29 61,38.18 v61,37.57 | v70.45,46.2 70.8,45.85 U5.6 | v65.87,45.73 65.82,45.73 65,44.91 63.89,44.91 63.74,44.76 63.74,42 63.11,41.37 63.11,40.51 v62.88,40.28
  Bottom 0.2: v70.45,46.2 66.6,46.2 66.13,45.73 v65.87,45.73 | v61,37.57 62.88,39.46 v62.88,40.28
I_ALT+
  Bottom 0.2: J6.1 95.04,5 R100.2
  pour Bottom (no thermals): 101.9,2.2 102.6,2.9 102.6,8.3 101.8,9.1 93.2,9.1 93.2,5.1 94.45,5.1 97.35,2.2
I_ALT-
  Bottom 0.2: J6.2 92.08,7.27 R100.1
  pour Bottom (no thermals): 92.7,5.1 92.7,14.95 92.05,15.6 85.15,15.6 83.6,14.05 83.6,6.55 85.05,5.1
I_LOAD  (via drill 0.35)
  Top 0.2: U2.8 56.59,47.71 56.59,47.03 58.95,44.67 v58.95,44.25 | U4.6 73.33,46.98 70.44,46.98 v70.4,47.01
  Bottom 0.2: v58.95,44.25 61.49,46.79 70.17,46.79 v70.4,47.01
INPUT_SHUNT+  (via drill 0.35)
  Top 0.18: v71.81,43.66 71.48,43.66 71.41,43.74 70.91,43.74 U5.4
  Bottom 0.18: v71.81,43.66 71.71,43.56 71.71,38.96 73.06,37.62 73.06,13.56 83.86,2.76 93.36,2.76 93.83,3.23 R100.2-KELVIN
INPUT_SHUNT-  (via drill 0.35)
  Top 0.18: v72.54,44.09 72.2,44.09 71.99,44.3 71,44.3 U5.5
  Bottom 0.18: v72.54,44.09 72.45,44 72.45,42.51 72.12,42.19 72.12,39.1 73.4,37.83 73.4,13.7 84,3.1 91.8,3.1 92.08,3.38 R100.1-KELVIN
LCD_A0  (via drill 0.35)
  Top 0.2: U2.14 59.59,47.71 59.59,47.08 60.09,46.58 60.41,46.58 62.08,44.91 62.08,43.14 v61.15,42.21 | v31,25.6 29.89,26.72 29.89,28.34 27.98,30.25 B1.15
  Bottom 0.2: v61.15,42.21 48.72,29.78 48.72,27.08 47.98,26.34 38.98,26.34 38.47,25.83 31.23,25.83 v31,25.6
LCD_LED
  Top 0.2: R25.2 22.55,3.85 B1.A
LCD_V0
  Top 0.2: C31.1 26.15,9.25 B1.1
LCD_V1
  Top 0.2: C30.1 25.95,10.75 B1.2
LCD_V2
  Top 0.2: C29.1 25.75,12.25 B1.3
LCD_V3
  Top 0.2: C28.1 25.55,13.75 B1.4
LCD_V4
  Top 0.2: C27.1 25.25,15.25 B1.5
LOAD_INPUT+
  Bottom 0.16: J4.1 99.5,40.5 83.9,56.1 83.9,79.6 Q2.PAD | Q2.PAD Q1.PAD Q1.2 | Q2.2 Q2.PAD
  pour Bottom (no thermals): 76.8,21.45 80.45,17.8 103.4,17.8 104,18.4 104,54.1 90.75,67.35 90.75,83.75 62.7,111.8 39.3,111.8 32.6,105.1 32.6,75.9 40.2,68.3 69.6,68.3 76.8,61.1
LOAD_INPUT-
  Top 0.16: R15.1 87.39,30.39 J4.2
  Top 0.2: R16.2 82.12,35.7 82.86,34.97 86.63,34.97 R15.1
  pour Top (no thermals): 86.2,36.15 86.2,34.7 86,34.5 81.9,34.5 80.3,32.9 80.3,26.9 82.2,25 93.7,25 95.35,26.65 95.35,35.2 94.2,36.35 86.4,36.35
N$2
  Top 0.2: U1.1 18.62,64.87 18.96,64.87 19.11,64.72 19.11,63.88 18.96,63.73 18.62,63.73 U1.3 18.24,60.33 19.06,59.51 19.06,56.99 18.91,56.84 18.09,56.84 17.38,57.55 C4.1
N$3  (via drill 0.35)
  Top 0.2: FB1.2 20.33,48.4 21.54,49.61 23.64,49.61 C13.A 27.99,45.26 27.99,45.19 28.14,45.04 28.96,45.04 29.67,45.75 C14.1 v30.05,47 | D2.1 23.92,64.57 24.26,64.57 25.29,63.54 25.29,62.63 27.68,60.24 v27.68,56.15
  Bottom 0.2: v30.05,47 30.05,52.42 30.34,52.71 30.34,53.5 v27.68,56.15
N$4
  Top 0.2: C3.1 22.23,60.72 20.46,60.72 20.11,61.06 20.11,61.54 20.46,61.88 20.68,61.88 21.73,62.93 21.73,63.77 20.86,64.64 U1.5 20.86,67.16 R1.2 22.75,69.05 D1.1
N$7
  Top 0.2: R3.2 19.65,62.14 20.8,63.3 | 20.8,63.3 U1.4 | 20.8,63.3 20.8,64.02 19.99,64.83 19.99,67.79 R1.1
NICE_BUTTON  (via drill 0.35)
  Top 0.2: U2.52 50.91,55.71 50.29,55.71 50.14,55.56 50.14,55.5 41,46.36 v40.49,46.36 | v37.42,31.21 37.2,30.98 37.2,11.32 34.6,8.72 RN2.1 34.6,5.65 SW2.2 SW2.1 | v35.85,35.55 35.5,35.9 v35.5,37.45
  Bottom 0.2: v40.49,46.36 35.5,41.36 v35.5,37.45 | v37.42,31.21 35.85,32.78 v35.85,35.55
NRST  (via drill 0.35)
  Top 0.2: U2.7 56.09,47.71 56.09,47.02 56.47,46.64 v56.31,46.48 | v40.85,41.15 32.75,41.15 v29.25,37.65
  Bottom 0.2: v40.85,41.15 43.86,44.16 43.86,44.38 47.3,47.82 47.85,47.82 49.19,46.48 50.5,46.48 51.1,47.09 51.83,47.09 52.43,46.48 v56.31,46.48 | v29.25,37.65 28.51,36.91 19.95,36.91 J100.5
OP_AMP_IN
  Top 0.2: U7.3 75.95,27.8 75.35,27.2 64,27.2 R18.1 59.3,31.42 56.53,28.65 56.4,28.65 R19.2
OSC_IN
  Top 0.2: C19.1 55.41,40.85 53.68,42.58 52.98,42.58 Y1.3 55,45.15 U2.5
OSC_OUT
  Top 0.2: C18.1 56.66,40.9 56.46,41.1 56.46,41.26 56.31,41.41 56.05,41.41 55.34,42.12 55.34,44.23 56.16,45.05 Y1.1 56.4,45.6 56.1,45.9 56.07,45.9 55.59,46.37 55.59,47.71 U2.6
OUTPUT_SHUNT+  (via drill 0.35)
  Top 0.2: v76.28,35.44 77.21,35.44 78.54,36.77 84.75,36.77 R15.2-KELVIN | v72.7,41.95 71.26,43.39 70.44,43.39 69.81,44.02 69.81,47.39 70.58,48.16 73.26,48.16 U4.4
  Bottom 0.2: v76.28,35.44 72.7,39.02 v72.7,41.95
OUTPUT_SHUNT-
  Top 0.2: U4.5 73.71,47.61 74.94,46.38 74.94,31.13 75.53,30.54 76.37,30.54 76.52,30.69 76.52,34.24 78.69,36.41 81.92,36.41 82.61,35.73 R15.1-KELVIN
PGND  (via drill 0.35)
  Top 0.2: R10.1 17.93,44 18.64,43.29 19.46,43.29 20.17,44 R11.1 16.86,47.69 16.49,47.69 16.05,48.13 v16.05,50 | 23.5,64 23.2,64 22.67,63.47 22.67,63.17 21.98,62.48 21.88,62.48 v20.7,61.3 23.15,61.3 C3.2 | 23.5,64 D2.2 | v66.35,42.3 65.8,42.85 C15.2 65.8,44.84 66.46,45.5 66.46,49.26 v67.59,50.39 | v67.65,42 67.65,41.4 67.83,41.22 67.83,40.38 67.68,40.23 67.34,40.23 U6.2 67.34,39.47 67.68,39.47 67.83,39.32 67.83,38.42 C21.2 70.4,37.05 v70.4,37.65 | v16,58.2 16,59.85 v17.05,60.9 | v17.05,60.9 17.05,60.4 R3.1 18.15,57.9 C4.2 | v17.05,60.9 17.05,63.45 17.52,63.92 17.86,63.92 U1.2 17.86,64.68 17.52,64.68 17.37,64.83 17.37,66.29 20.7,69.62 24.16,69.62 24.31,69.47 | 23.5,64 23.12,64.38 22.31,64.38 21.89,64.8 21.89,65.1 22.67,65.88 23.46,65.88 24.31,66.73 24.31,67.57 24.16,67.72 23.82,67.72 D1.2 23.82,68.48 24.16,68.48 24.31,68.63 24.31,69.47 | v69.79,52.91 70.91,52.91 J1.1 | J2.3 98.5,55.5 J2.2 103.26,49.04 103.26,18.65 102.16,17.55 80.84,17.55 72.38,26.02 72.07,26.02 v71.47,26.62 | 24.31,69.47 25.19,69.47 25.34,69.62 29.18,69.62 36.22,62.58 63.85,62.58 65.08,61.35 66.6,61.35 v66.6,61.55 | v67.38,59.88 66.58,59.08 v66.53,59.08
  Bottom 0.2: v16.05,50 16.05,58.15 v16,58.2 | v17.05,60.9 17.45,61.3 v20.7,61.3 | v66.35,42.3 66.65,42 v67.65,42 | v67.59,50.39 69.79,52.59 v69.79,52.91 66.39,52.91 65.94,52.47 65.46,52.47 65.11,52.81 65.11,53.29 66.53,54.7 v66.53,59.08 | v71.47,26.62 71.47,26.93 70.74,27.67 70.74,37.31 v70.4,37.65 | v66.6,61.55 66.6,60.66 v67.38,59.88
RX  (via drill 0.35)
  Top 0.2: v46.41,53.59 44.07,51.25 RN1.1 43.39,51.25 42.81,50.67 41.89,50.67 41.74,50.82 41.74,50.93 38.27,54.4 36.03,54.4 35.5,54.93 35.5,56.28 33.62,58.16 30.52,58.16 25.79,53.42 U3.15 | v55.33,60.95 55.5,60.78 U2.43
  Bottom 0.2: v46.41,53.59 47.56,54.74 47.56,61.44 47.91,61.78 48.39,61.78 50.16,60.02 54.16,60.02 55.09,60.95 v55.33,60.95
RXLED_C
  Top 0.2: DS1.C 36.25,59.6 R2.2
SHUNT_LOW
  Top 0.5: R15.2 86.63,38.25 Q4.3 Q4.1
  Top 1: R14.1 82.3,37.65 Q4.1
  pour Top (no thermals): 81.4,37.95 81.4,37.2 81.8,36.8 82.5,36.8 84.4,38.7 85.55,38.7 86.2,38.05 86.2,36.95 86.25,36.9 88.75,36.9 88.75,37.9 88.25,38.4 87.3,38.4 87.1,38.6 87.1,40.15 83.95,40.15 82.7,38.9 82.7,38.8 81.85,37.95
SHUNT_MID
  Top 0.2: Q3.2 81.85,42.95 | Q4.6 87,45.45
  Top 0.5: Q4.PAD 84.09,44.7 Q4.8 | Q4.8 Q4.7 87,45.45 Q4.5 | Q3.3 81.85,42.95 Q3.1 81.85,39.35 R14.2 | Q4.8 84.09,41.2 R14.2 | R14.2 81.9,39 R13.1
  pour Top (no thermals): 80.2,39.6 81.35,39.6 81.35,43.75 81.6,44 83.6,44 83.65,44.05 83.65,46.35 83.6,46.4 88.35,46.4 88.45,46.3 88.45,40.9 88.35,40.8 88.3,40.75 84.1,40.75 83.55,40.2 82.25,38.9 81.45,38.9 81.15,38.6 80.15,38.6 80.15,39.55
SPI_MOSI  (via drill 0.35)
  Top 0.2: v64.5,53.05 64.28,52.83 63.61,52.83 63.58,52.8 U2.23
  Bottom 0.2: B1.13 24.63,27.25 25.69,26.19 38.23,26.19 38.81,26.77 39.71,26.77 64.59,51.64 64.59,52.13 64.5,52.21 v64.5,53.05
SPI_SCK  (via drill 0.35)
  Top 0.2: U2.21 63.91,51.8 v64,51.88 | v29.3,28.1 28.65,28.75 B1.14
  Bottom 0.2: v64,51.88 64,51.59 41.62,29.2 33.06,29.2 31.96,28.1 v29.3,28.1
SWCLK  (via drill 0.35)
  Top 0.2: v40.49,47.19 41.32,47.19 49.75,55.62 49.75,56.8 50.25,57.3 U2.49
  Bottom 0.2: v40.49,47.19 27.8,34.49 23.75,34.49 23.05,33.79 23.05,30.19 22.55,29.69 J100.2
SWDIO  (via drill 0.35)
  Top 0.2: U2.46 54.01,60.86 53.01,61.86 50.69,61.86 50.03,61.2 v48.15,61.2
  Bottom 0.2: J100.4 19.65,34.87 27.67,34.87 39.91,47.11 39.91,47.43 40.84,48.36 42.01,48.36 42.1,48.45 45.31,48.45 49.33,52.47 49.33,53 48.15,54.18 v48.15,61.2
SWO  (via drill 0.35)
  Top 0.2: U2.55 50.91,54.21 50.29,54.21 48.84,52.76 v48.74,52.76
  Bottom 0.2: J100.6 19.85,40.15 32.44,40.15 39.55,47.26 39.55,47.58 40.92,48.95 45.25,48.95 48.74,52.44 v48.74,52.76
TO_LED  (via drill 0.35)
  Top 0.2: U2.54 50.91,54.71 49.86,54.71 47.94,52.78 47.94,51.36 44.8,48.22 v44.8,43.98 | v45.87,41.52 47.04,40.35 R12.2
  Bottom 0.2: v44.8,43.98 45.87,42.91 v45.87,41.52
TO_LED_ANODE
  Top 0.2: R12.1 52.45,40.35 55.8,37 DS3.A
TX  (via drill 0.35)
  Top 0.2: U2.42 56,60.54 55.91,60.62 55.91,61.19 54.88,62.22 48.34,62.22 47.56,61.44 47.56,60.96 47.91,60.62 48.67,60.62 v48.95,60.34 | RN1.2 44.04,52.34 44.65,52.34 45.83,53.51 45.83,53.83 | v49.2,59.05 49.2,57.2 45.83,53.83 | U3.2 22.48,55.15 22.48,55.41 22.71,55.64 v22.71,57.66 | v45,55.55 45.83,54.72 45.83,53.83
  Bottom 0.2: v48.95,60.34 49.2,60.09 v49.2,59.05 | v22.71,57.66 23.42,57.66 27.27,61.52 39.03,61.52 v45,55.55
TXLED_C
  Top 0.2: DS2.C R5.2
USB5V  (via drill 0.35)
  Top 0.18: J3.1 15.06,48.4 FB1.1
  Top 0.2: v27.2,47.1 27.9,47.8 C11.1 27.9,49.63 27.34,50.19 27.34,51.31 27.49,51.46 28.11,51.46 28.52,51.87 28.52,52.54 30.11,54.14 30.11,54.37 30.63,54.88 30.84,54.88 v32.07,56.12 | v15.3,47.06 15.4,47.16 FB1.1
  Bottom 0.2: v27.2,47.1 27.16,47.06 v15.3,47.06 | v32.07,56.12 32.07,56.43 32.16,56.52 32.16,58.84 TP1.1
USB_CONN_N
  Top 0.18: J3.2 13.35,53.75 13.45,53.65 13.45,52.9 14.95,51.4 15.6,51.4 | C8.1 15.7,51.5 R6.1
  Top 0.21: C8.1 15.6,51.4 15.7,51.5
USB_CONN_P
  Top 0.18: J3.3 12.21,55.75 C7.1 17.1,54.2 R4.1
USB_N
  Top 0.18: U3.7 19.88,52.77 19.62,52.52 19.6,52.52 19.45,52.37 19.45,52.35 R6.2
USB_P
  Top 0.18: R4.2 19.08,53.42 U3.6
USB_RESET  (via drill 0.35)
  Top 0.2: U3.9 19.92,50.3 v19.65,50.3 | v19.75,56.15 19.2,55.6 C6.1 | R9.2 31.05,49.8 31.05,50.73 29.96,51.82 29.33,51.82 v29.1,52.05
  Bottom 0.2: v19.65,50.3 19.75,50.4 v19.75,56.15 24.42,56.15 27.76,52.81 28.34,52.81 v29.1,52.05
V_ALT
  Top 0.2: U2.9 57.09,47.71 57.09,47.04 59.53,44.59 59.53,44.01 59.4,43.87 59.4,37.35 59.44,37.31 59.44,35.42 58.59,34.57 58.59,31.54 56.91,29.86 56.91,29.54 56.38,29.01 55.64,29.01 46.79,20.16 46.79,15.24 46.94,15.09 47.48,15.09 48.1,14.47 48.1,13.3 48.85,12.55 R20.2 48.85,12.25 47.35,10.75 R21.1
V_LOAD  (via drill 0.35)
  Top 0.2: U2.11 58.09,47.71 58.09,47.06 59.65,45.5 59.85,45.5 60.55,44.8 60.55,41.13 60.65,41.03 v60.65,38.88 | R24.1 47.35,15.75 48.85,14.25 R23.2 48.9,14.05 v49.9,14.05
  Bottom 0.2: v49.9,14.05 60.36,24.51 60.36,32.96 58.27,35.05 58.27,36.5 v60.65,38.88
VOUT
  Top 0.2: B1.10 24.93,22.75 25.89,21.79 26.71,21.79 27.42,22.5 C24.2
VSENSE  (via drill 0.35)
  Top 0.2: v41.08,47.77 38.7,50.15 R8.1
  Bottom 0.2: J100.1 22.05,27.15 23.45,28.55 23.45,33.65 23.85,34.05 27.91,34.05 30.73,36.86 35.74,36.86 36.09,37.21 36.09,41.12 41.08,46.12 v41.08,47.77
VSENSE_ALT
  Top 0.2: J5.1 55.4,5 49.7,10.7 R21.2
VSENSE_GND
  Top 0.2: R22.2 50.89,9 56.9,2.99 71.34,2.99 J5.3
VSENSE_LOAD
  Top 0.2: R24.2 64.15,15.8 J5.2

## Text on the board
tPlace: RX | TX | Electronic Load V1.0